# EAGLE design FAL65816_cpua (EAGLE 7.2.0)
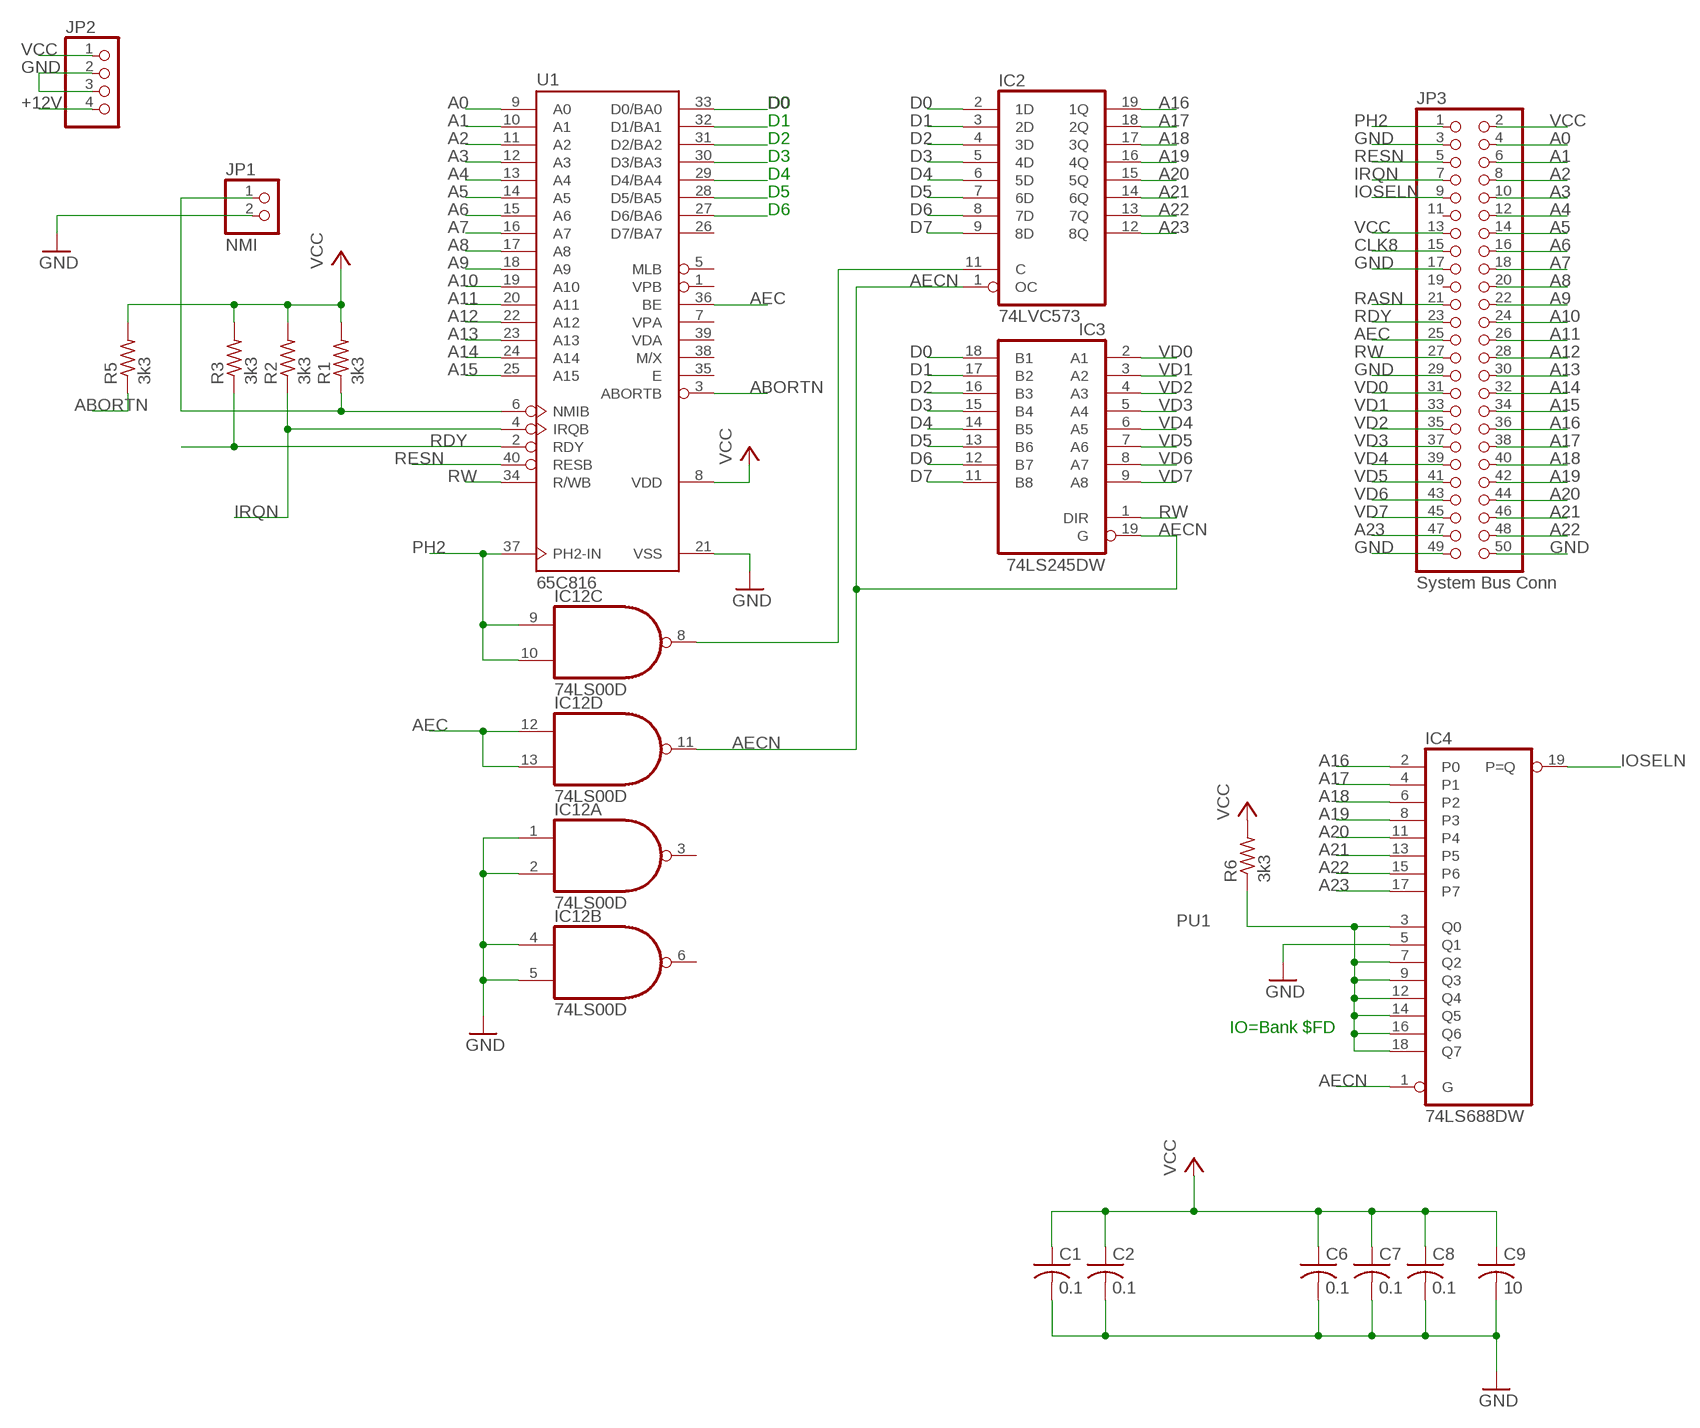
[diagram p0: schematic, sheet 1]

## Parts
C1  0.1  C-US050-024X044  [C050-024X044]
C2  0.1  C-US050-024X044  [C050-024X044]
C6  0.1  C-US050-024X044  [C050-024X044]
C7  0.1  C-US050-024X044  [C050-024X044]
C8  0.1  C-US050-024X044  [C050-024X044]
C9  10  C-US050-024X044  [C050-024X044]
IC2  74LVC573  [SO20W]
IC3  74LS245DW  [SO20W]
IC4  74LS688DW  [SO20W]
IC12  74LS00D  [SO14]
JP1  NMI  PINHD-1X2  [1X02]
JP2  PINHD-1X4/90  [1X04/90]
JP3  System Bus Conn  PINHD-2X25/90  [2X25/90]
R1  3k3  R-US_0207/10  [0207/10]
R2  3k3  R-US_0207/10  [0207/10]
R3  3k3  R-US_0207/10  [0207/10]
R5  3k3  R-US_0207/10  [0207/10]
R6  3k3  R-US_0204/7  [0204/7]
U1  65C816  W65C816SP  [DIP-40]

## Nets
+12V: JP2.4
A0: JP3.4 U1.9(A0)
A1: JP3.6 U1.10(A1)
A2: JP3.8 U1.11(A2)
A3: JP3.10 U1.12(A3)
A4: JP3.12 U1.13(A4)
A5: JP3.14 U1.14(A5)
A6: JP3.16 U1.15(A6)
A7: JP3.18 U1.16(A7)
A8: JP3.20 U1.17(A8)
A9: JP3.22 U1.18(A9)
A10: JP3.24 U1.19(A10)
A11: JP3.26 U1.20(A11)
A12: JP3.28 U1.22(A12)
A13: JP3.30 U1.23(A13)
A14: JP3.32 U1.24(A14)
A15: JP3.34 U1.25(A15)
A16: IC2.19(1Q) IC4.2(P0) JP3.36
A17: IC2.18(2Q) IC4.4(P1) JP3.38
A18: IC2.17(3Q) IC4.6(P2) JP3.40
A19: IC2.16(4Q) IC4.8(P3) JP3.42
A20: IC2.15(5Q) IC4.11(P4) JP3.44
A21: IC2.14(6Q) IC4.13(P5) JP3.46
A22: IC2.13(7Q) IC4.15(P6) JP3.48
A23: IC2.12(8Q) IC4.17(P7) JP3.47
ABORTN: R5.1 U1.3(ABORTB)
AEC: IC12.12(D:I0) IC12.13(D:I1) JP3.25 U1.36(BE)
AECN: IC2.1(OC) IC3.19(G) IC4.1(G) IC12.11(D:O)
CLK8: JP3.15
D0: IC2.2(1D) IC3.18(B1) U1.33(D0/BA0)
D1: IC2.3(2D) IC3.17(B2) U1.32(D1/BA1)
D2: IC2.4(3D) IC3.16(B3) U1.31(D2/BA2)
D3: IC2.5(4D) IC3.15(B4) U1.30(D3/BA3)
D4: IC2.6(5D) IC3.14(B5) U1.29(D4/BA4)
D5: IC2.7(6D) IC3.13(B6) U1.28(D5/BA5)
D6: IC2.8(7D) IC3.12(B7) U1.27(D6/BA6)
D7: IC2.9(8D) IC3.11(B8)
GND: C1.2 C2.2 C6.2 C7.2 C8.2 C9.2 IC4.5(Q1) IC12.1(A:I0) IC12.2(A:I1) IC12.4(B:I0) IC12.5(B:I1) JP1.2 JP2.2 JP2.3 JP3.3 JP3.17 JP3.29 JP3.49 JP3.50 U1.21(VSS)
IOSELN: IC4.19(P=Q) JP3.9
IRQN: JP3.7 R2.1 U1.4(IRQB)
N$1: JP1.1 R1.1 U1.6(NMIB)
N$3: IC2.11(C) IC12.8(C:O)
PH2: IC12.9(C:I0) IC12.10(C:I1) JP3.1 U1.37(PH2-IN)
PU1: IC4.3(Q0) IC4.7(Q2) IC4.9(Q3) IC4.12(Q4) IC4.14(Q5) IC4.16(Q6) IC4.18(Q7) R6.1
RASN: JP3.21
RDY: JP3.23 R3.1 U1.2(RDY)
RESN: JP3.5 U1.40(RESB)
RW: IC3.1(DIR) JP3.27 U1.34(R/WB)
VCC: C1.1 C2.1 C6.1 C7.1 C8.1 C9.1 JP2.1 JP3.2 JP3.13 R1.2 R2.2 R3.2 R5.2 R6.2 U1.8(VDD)
VD0: IC3.2(A1) JP3.31
VD1: IC3.3(A2) JP3.33
VD2: IC3.4(A3) JP3.35
VD3: IC3.5(A4) JP3.37
VD4: IC3.6(A5) JP3.39
VD5: IC3.7(A6) JP3.41
VD6: IC3.8(A7) JP3.43
VD7: IC3.9(A8) JP3.45
Unconnected: IC12.3(A:O) IC12.6(B:O) JP3.11 JP3.19 U1.1(VPB) U1.5(MLB) U1.7(VPA) U1.26(D7/BA7) U1.35(E) U1.38(M/X) U1.39(VDA)

## Notes on the sheet
- IO=Bank $FD

## Power pins joined to a net without a drawn wire
GND: IC2.10(GND) IC3.10(GND) IC4.10(GND) IC12.7(P:GND)
VCC: IC2.20(VCC) IC3.20(VCC) IC4.20(VCC) IC12.14(P:VCC)

## Library data of the parts
C1 C2 C6-C9 = rcl:C-US: CAPACITOR, American symbol
IC2 = FT74xx:74*573: 8-bit D latch BUS DRIVER
IC3 = FT74xx:74*245: Octal BUS TRANSCEIVER, 3-state
IC4 = FT74xx:74*688: 8-bit MAGNITUDE/IDENTITY COMPARATOR, totem pole
IC12 = 74xx-us:74*00: Quad 2-input NAND gate
JP1 = pinhead:PINHD-1X2: PIN HEADER
JP2 = pinhead:PINHD-1X4: PIN HEADER
JP3 = pinhead:PINHD-2X25: PIN HEADER
R1-R3 R5 R6 = resistor:R-US_: RESISTOR, American symbol
U1 = 65xxx:W65C816SP: Wetern Digital Version

## Board
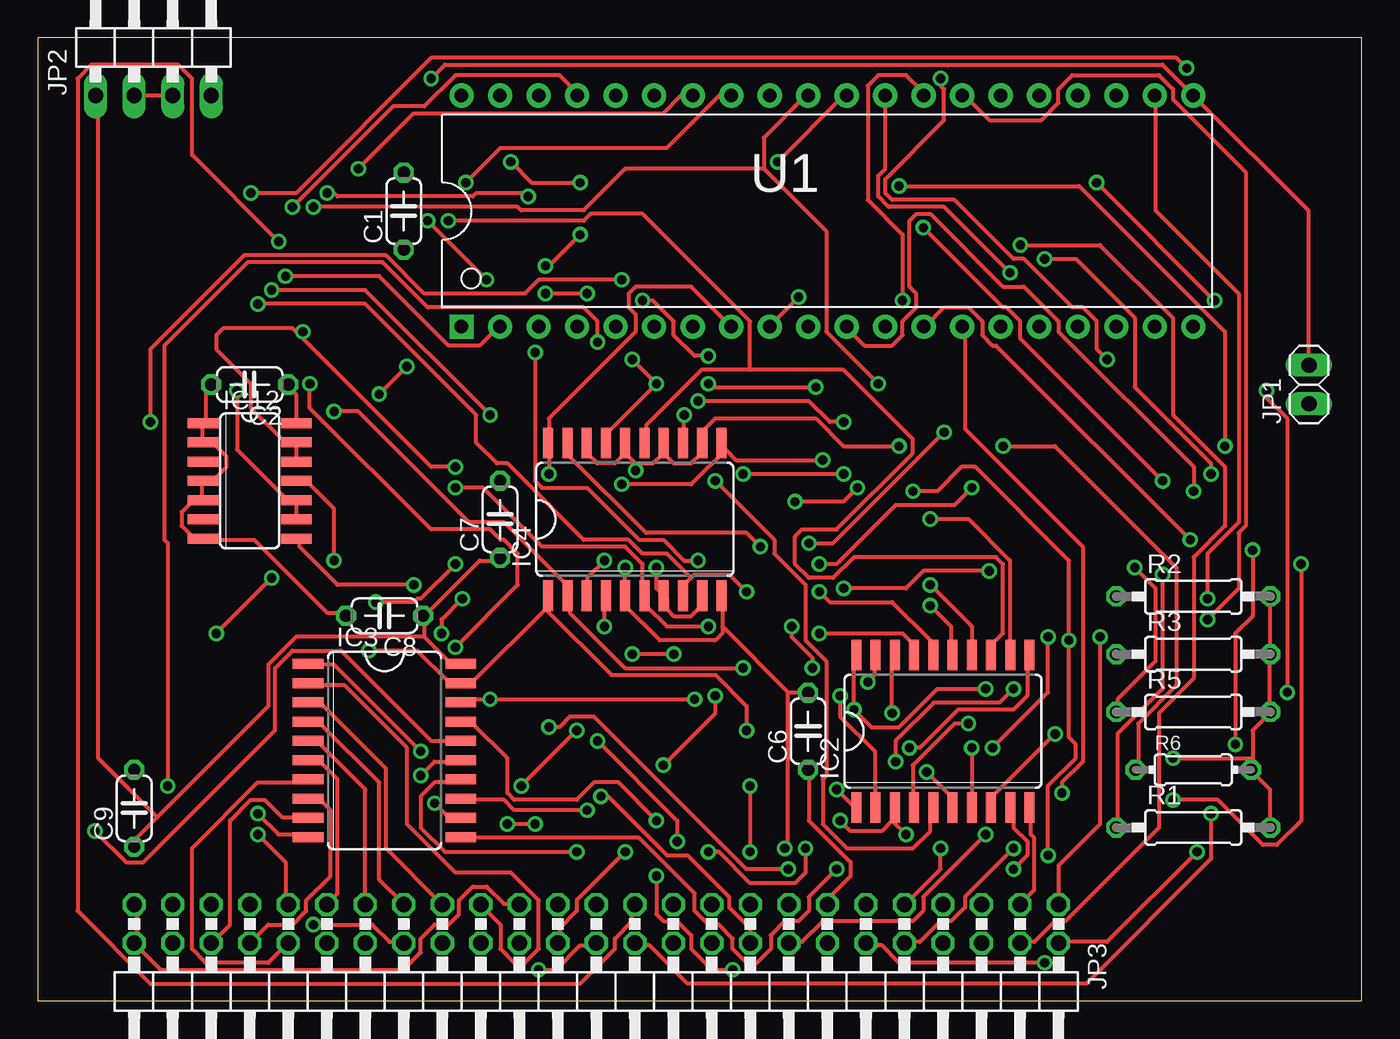
[diagram p1: board, top side]
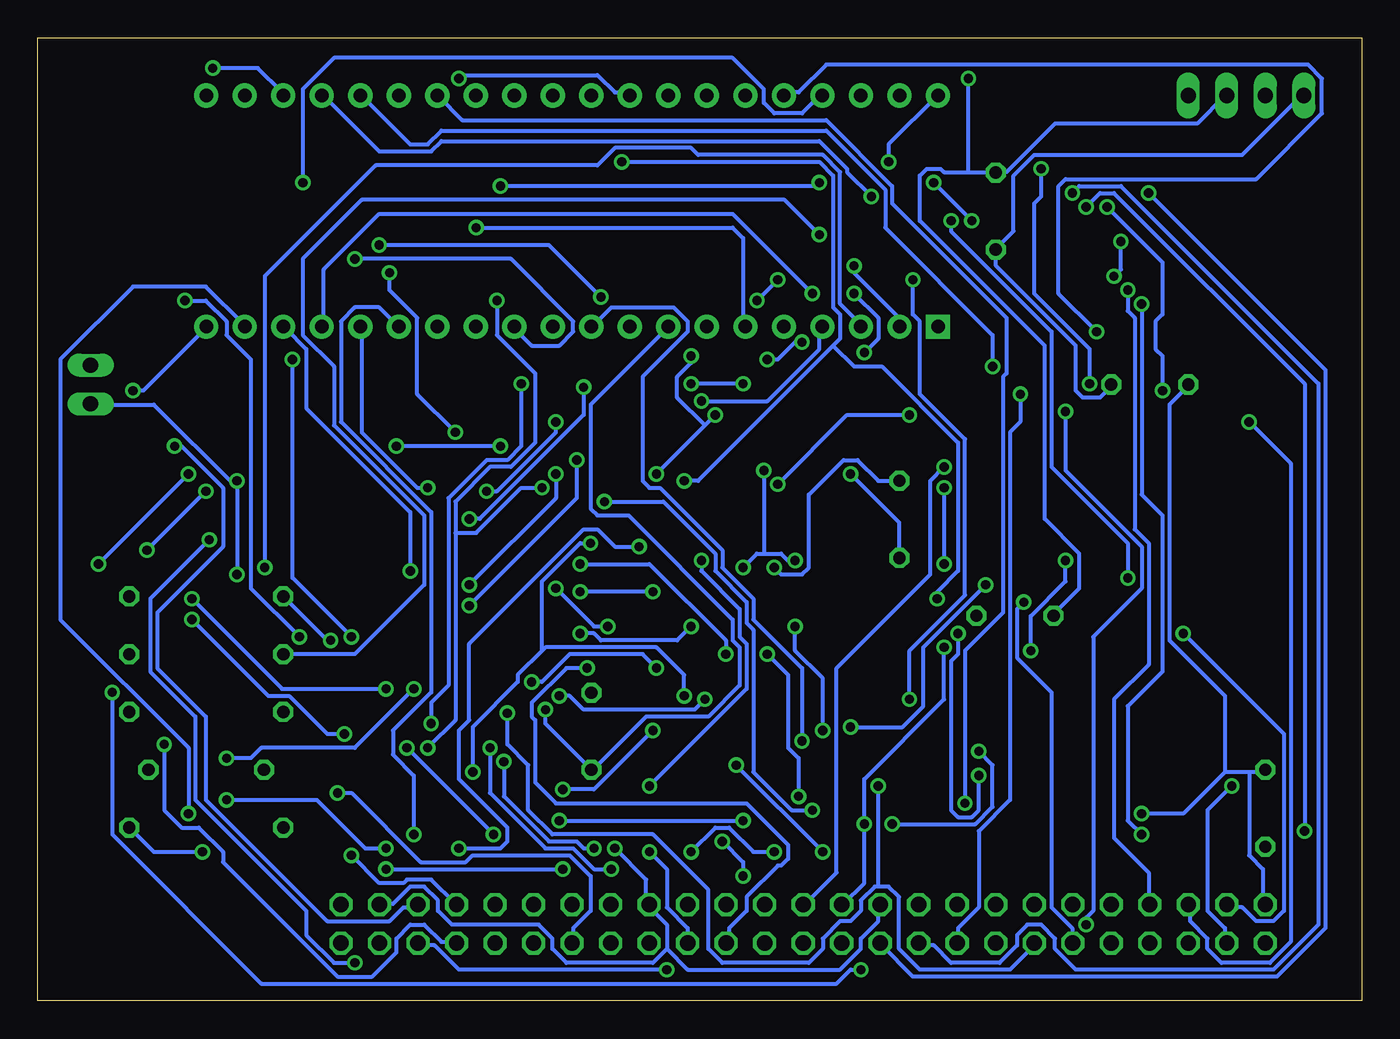
[diagram p2: board, bottom side, seen from below]

Size 87.3 x 63.49 mm. Coordinates in mm from the lower left corner, seen from the top.
Outline: 0,0 87.3,0 87.3,63.49 0,63.49 0,0
Copper layers (1*16): Top 0.035mm / dielectric 1.5mm / Bottom 0.035mm
Design rules "default": minimum track width 10mil, minimum drill 24mil, track to track 8mil, track to pad 8mil, pad to pad 8mil, via to via 8mil, smd to smd 8mil, copper to edge 40mil, drill to drill 8mil, minimum pad ring 10mil, minimum via ring 8mil, stop-mask expansion 4mil, vias tented up to drill 0mil, thermal gap 10mil

### Footprints (pad centres in the part's own frame; a part is rotated, then mirrored left to right if it is on the bottom)
C050-024X044 = drill 0.813 octagon: 1 -2.54,0; 2 2.54,0
SO20W = smd 0.66 x 2.032: 1 -5.715,-5.029; 2 -4.445,-5.029; 3 -3.175,-5.029; 4 -1.905,-5.029; 5 -0.635,-5.029; 6 0.635,-5.029; 7 1.905,-5.029; 8 3.175,-5.029; 9 4.445,-5.029; 10 5.715,-5.029; 11 5.715,5.029; 12 4.445,5.029; 13 3.175,5.029; 14 1.905,5.029; 15 0.635,5.029; 16 -0.635,5.029; 17 -1.905,5.029; 18 -3.175,5.029; 19 -4.445,5.029; 20 -5.715,5.029
SO14 = smd 0.66 x 2.032: 1 -3.81,-3.073; 2 -2.54,-3.073; 3 -1.27,-3.073; 4 0,-3.073; 5 1.27,-3.073; 6 2.54,-3.073; 7 3.81,-3.073; 8 3.81,3.073; 9 2.54,3.073; 10 1.27,3.073; 11 0,3.073; 12 -1.27,3.073; 13 -2.54,3.073; 14 -3.81,3.073
1X02 = drill 1.016 long: 1 -1.27,0; 2 1.27,0
1X04/90 = drill 1.016 long: 1 -3.81,-3.81; 2 -1.27,-3.81; 3 1.27,-3.81; 4 3.81,-3.81
2X25/90 = drill 1.016 octagon: 1 -29.21,-6.35; 2 -29.21,-3.81; 3 -26.67,-6.35; 4 -26.67,-3.81; 5 -24.13,-6.35; 6 -24.13,-3.81; 7 -21.59,-6.35; 8 -21.59,-3.81; 9 -19.05,-6.35; 10 -19.05,-3.81; 11 -16.51,-6.35; 12 -16.51,-3.81; 13 -13.97,-6.35; 14 -13.97,-3.81; 15 -11.43,-6.35; 16 -11.43,-3.81; 17 -8.89,-6.35; 18 -8.89,-3.81; 19 -6.35,-6.35; 20 -6.35,-3.81; 21 -3.81,-6.35; 22 -3.81,-3.81; 23 -1.27,-6.35; 24 -1.27,-3.81; 25 1.27,-6.35; 26 1.27,-3.81; 27 3.81,-6.35; 28 3.81,-3.81; 29 6.35,-6.35; 30 6.35,-3.81; 31 8.89,-6.35; 32 8.89,-3.81; 33 11.43,-6.35; 34 11.43,-3.81; 35 13.97,-6.35; 36 13.97,-3.81; 37 16.51,-6.35; 38 16.51,-3.81; 39 19.05,-6.35; 40 19.05,-3.81; 41 21.59,-3.81; 42 21.59,-6.35; 43 24.13,-3.81; 44 24.13,-6.35; 45 26.67,-3.81; 46 26.67,-6.35; 47 29.21,-3.81; 48 29.21,-6.35; 49 31.75,-3.81; 50 31.75,-6.35
0207/10 = drill 0.813 octagon: 1 -5.08,0; 2 5.08,0
0204/7 = drill 0.813 octagon: 1 -3.81,0; 2 3.81,0
DIP-40 = drill 0.889 pad 1.6 square: 1 -22.86,-7.62 | drill 0.889 pad 1.6: 2 -20.32,-7.62; 3 -17.78,-7.62; 4 -15.24,-7.62; 5 -12.7,-7.62; 6 -10.16,-7.62; 7 -7.62,-7.62; 8 -5.08,-7.62; 9 -2.54,-7.62; 10 0,-7.62; 11 2.54,-7.62; 12 5.08,-7.62; 13 7.62,-7.62; 14 10.16,-7.62; 15 12.7,-7.62; 16 15.24,-7.62; 17 17.78,-7.62; 18 20.32,-7.62; 19 22.86,-7.62; 20 25.4,-7.62; 21 25.4,7.62; 22 22.86,7.62; 23 20.32,7.62; 24 17.78,7.62; 25 15.24,7.62; 26 12.7,7.62; 27 10.16,7.62; 28 7.62,7.62; 29 5.08,7.62; 30 2.54,7.62; 31 0,7.62; 32 -2.54,7.62; 33 -5.08,7.62; 34 -7.62,7.62; 35 -10.16,7.62; 36 -12.7,7.62; 37 -15.24,7.62; 38 -17.78,7.62; 39 -20.32,7.62; 40 -22.86,7.62

### Placement (x,y rotation side)
C1  24.13,52.07 90 top
C2  13.97,40.64 180 top
C6  50.8,17.78 90 top
C7  30.48,31.75 90 top
C8  22.86,25.4 180 top
C9  6.35,12.7 90 top
IC2  59.69,17.78 0 top
IC3  22.86,16.51 270 top
IC4  39.37,31.75 0 top
IC12  13.97,34.29 270 top
JP1  83.82,40.64 90 top
JP2  7.62,63.5 0 top
JP3  38.1,0 180 top
R1  76.2,11.43 0 top
R2  76.2,26.67 0 top
R3  76.2,22.86 0 top
R5  76.2,19.05 0 top
R6  76.2,15.24 0 top
U1  50.8,52.07 0 top

### Tracks (layer width: path | path; a pad name or v marks a point on that pad's centre or on a via)
A0  (via drill 0.61)
  Top 0.254: v64.8,49.84 70.05,49.84 74.85,45.03 74.85,38.63 78.28,35.2 78.28,31.32 76.22,29.26 76.22,21.26 73.94,18.97 73.94,11.43 67.77,5.26 67.08,5.26 65.71,3.89 64.8,3.89 JP3.4 | v50.17,46.41 48.34,44.58 U1.9
  Bottom 0.254: v64.8,49.84 53.59,49.84 v50.17,46.41
A1  (via drill 0.61)
  Top 0.254: v45.82,2.06 44.45,2.06 43.08,3.43 43.08,4.34 42.16,5.26 41.25,5.26 40.79,5.71 v40.79,8.23 | v42.16,10.52 42.16,11.89 v36.91,17.14
  Bottom 0.254: v45.82,2.06 59.54,2.06 61.14,3.66 62.05,3.66 JP3.6 | v40.79,8.23 40.79,9.14 v42.16,10.52 | v36.91,17.14 36.91,21.95 40.11,25.15 40.11,26.52 42.16,28.57 42.16,29.72 46.28,33.83 46.97,33.83 47.42,34.29 47.42,41.15 44.45,44.12 44.45,44.81 45.36,45.72 49.48,45.72 50.62,44.58 U1.10
A2  (via drill 0.61)
  Top 0.254: v78.97,16.92 78.97,24.23 80.11,25.38 v80.11,29.72 | v76.22,33.6 76.22,35.2 67.31,44.12 67.31,44.81 65.02,47.09 63.65,47.09 58.85,51.89 57.94,51.89 57.48,51.44 57.48,47.09 57.94,46.63 57.94,45.72 57.02,44.81 57.02,43.89 56.34,43.2 54.51,43.2 53.36,44.35 U1.11
  Bottom 0.254: v78.97,16.92 78.97,12.57 77.83,11.43 76.68,11.43 75.08,9.83 75.08,9.14 67.54,1.6 65.25,1.6 63.65,3.2 63.65,4.12 62.74,5.03 61.82,5.03 60.68,3.89 59.77,3.89 JP3.8 | v76.22,33.6 v80.11,29.72
A3  (via drill 0.61)
  Top 0.254: v64.34,10.06 61.14,6.86 61.14,6.17 60.22,5.26 59.54,5.26 58.17,3.89 57.25,3.89 JP3.10 | v74.85,13.26 77.83,13.26 80.8,10.29 81.71,10.29 83.31,11.89 v83.31,28.8 | v77.37,34.75 77.37,35.43 72.34,40.46 72.34,45.03 68.45,48.92 v66.4,48.92
  Bottom 0.254: v64.34,10.06 65.71,10.06 68.91,13.26 v74.85,13.26 | v77.37,34.75 v83.31,28.8 | v66.4,48.92 56.11,48.92 51.99,44.81 51.99,44.12 52.91,43.2 54.74,43.2 55.88,44.35 U1.12
A4  (via drill 0.61)
  Top 0.254: v66.4,2.52 56.79,2.52 55.65,3.66 54.74,3.66 JP3.12 | v76,30.4 63.19,43.2 62.97,43.2 62.28,43.89 62.28,44.81 61.37,45.72 59.77,45.72 58.62,44.58 U1.13
  Bottom 0.254: v66.4,2.52 67.77,2.52 69.6,4.34 69.6,5.94 76.91,13.26 76.91,18.75 79.88,21.72 79.88,26.52 v76,30.4
A5  (via drill 0.61)
  Top 0.254: v67.54,13.72 67.54,14.4 68.91,15.77 68.91,29.95 61.14,37.72 61.14,44.35 U1.14
  Bottom 0.254: v67.54,13.72 66.62,13.72 62.05,9.14 59.08,9.14 58.62,9.6 52.22,9.6 50.85,8.23 50.85,5.94 51.99,4.8 51.99,3.89 JP3.14
A6  (via drill 0.61)
  Top 0.254: v62.51,10.97 58.39,6.86 58.39,5.94 57.71,5.26 51.77,5.26 50.39,3.89 49.71,3.89 JP3.16
  Bottom 0.254: v62.51,10.97 62.51,14.86 63.88,16.23 63.88,17.83 61.37,20.34 61.37,32.23 67.31,38.18 67.31,44.81 66.4,45.72 64.8,45.72 63.65,44.58 U1.15
A7  (via drill 0.61)
  Top 0.254: v37.14,13.49 37.59,13.49 41.48,9.6 42.85,9.6 45.59,6.86 45.59,6.17 46.97,4.8 46.97,3.89 JP3.18 | v41.94,22.86 v39.19,22.86 | v51.54,28.8 52.68,28.8 56.57,32.69 60.45,32.69 v61.59,33.83
  Bottom 0.254: v37.14,13.49 37.14,16 37.82,16.69 37.82,21.49 v39.19,22.86 | v41.94,22.86 41.94,23.77 46.97,28.8 v51.54,28.8 | v61.59,33.83 62.28,33.83 65.94,37.49 65.94,44.35 U1.16
A8  (via drill 0.61)
  Top 0.254: v46.97,14.17 v46.97,9.83 | v43.54,29.03 42.62,29.03 41.25,30.4 39.65,30.4 36.22,33.83 33.25,33.83 32.79,34.29 v32.79,42.75 | v36.22,46.63 v33.48,46.63
  Bottom 0.254: JP3.20 44.45,4.8 45.82,6.17 45.82,8.69 v46.97,9.83 | v46.97,14.17 40.56,20.57 40.56,23.55 41.02,24 41.02,25.83 43.54,28.35 v43.54,29.03 | v32.79,42.75 31.88,43.66 31.88,45.03 v33.48,46.63 | v36.22,46.63 41.48,51.89 64.8,51.89 68.45,48.23 68.45,44.58 U1.17
A9  (via drill 0.61)
  Top 0.254: v51.08,21.95 51.08,22.63 49.71,24 v49.71,24.69 | v53.14,27.2 57.25,27.2 58.39,28.35 v62.74,28.35
  Bottom 0.254: v51.08,21.95 52.45,21.95 54.74,19.66 54.74,18.75 54.51,18.52 54.51,14.4 53.14,13.03 40.56,13.03 37.82,10.29 37.82,9.37 38.28,8.91 38.51,8.91 40.56,6.86 40.56,5.94 41.71,4.8 41.71,3.89 JP3.22 | v49.71,24.69 50.62,24.69 v53.14,27.2 | v62.74,28.35 62.74,32.23 69.6,39.09 69.6,42.98 70.97,44.35 U1.18
A10  (via drill 0.61)
  Top 0.254: v77.37,12.34 77.37,9.37 69.14,1.14 42.85,1.14 40.33,3.66 39.42,3.66 JP3.24
  Bottom 0.254: v77.37,12.34 77.37,16.69 85.83,25.15 85.83,42.29 81.03,47.09 76.22,47.09 73.71,44.58 U1.19
A11  (via drill 0.61)
  Top 0.254: v33.02,2.06 34.16,2.06 35.76,3.66 36.68,3.66 JP3.26 | v82.4,20.34 82.4,38.41 81.03,39.78 v81.03,40.23
  Bottom 0.254: v33.02,2.06 33.71,2.06 34.62,1.14 72.57,1.14 82.4,10.97 v82.4,20.34 | v81.03,40.23 80.34,40.23 76.22,44.35 U1.20
A12  (via drill 0.61)
  Top 0.254: v38.73,9.83 35.53,6.63 35.53,5.94 34.39,4.8 34.39,3.89 JP3.28 | v44.22,9.83 44.91,9.83 46.97,7.77 49.94,7.77 50.62,8.46 v50.62,10.06 | v56.57,15.77 56.57,17.14 59.08,19.66 63.42,19.66 v64.34,20.57 | v77.14,26.52 77.14,29.49 79.2,31.55 79.2,46.63 73.71,52.12 73.71,59.66 U1.22
  Bottom 0.254: v38.73,9.83 40.11,9.83 41.71,11.43 42.62,11.43 v44.22,9.83 | v50.62,10.06 51.31,10.06 51.77,10.52 53.59,10.52 56.57,13.49 v56.57,15.77 | v64.34,20.57 71.2,20.57 v77.14,26.52
A13  (via drill 0.61)
  Top 0.254: v14.05,53.26 17.02,53.26 25.93,62.18 75.08,62.18 v75.77,61.49
  Bottom 0.254: v14.05,53.26 2.39,41.6 2.39,4.8 5.59,1.6 29.59,1.6 31.65,3.66 JP3.30 | v75.77,61.49 72.8,61.49 71.2,59.89 U1.23
A14  (via drill 0.61)
  Top 0.254: v19.07,53.26 19.53,53.26 19.76,53.03 28.68,53.03 28.9,53.26 32.11,53.26 v32.33,53.03
  Bottom 0.254: v19.07,53.26 18.62,53.72 15.88,53.72 2.85,40.69 2.85,5.03 5.82,2.06 18.85,2.06 20.22,3.43 20.22,4.12 21.13,5.03 22.05,5.03 22.73,4.34 22.73,3.66 23.88,2.52 27.08,2.52 28.22,3.66 29.13,3.66 JP3.32 | v32.33,53.03 33.93,54.63 33.93,54.86 35.76,56.69 60.68,56.69 61.37,56.01 64.8,56.01 68.45,59.66 U1.24
A15  (via drill 0.61)
  Top 0.254: v24.33,41.83 v22.5,40.01
  Bottom 0.254: v22.5,40.01 22.5,38.18 23.19,37.49 23.19,13.26 25.25,11.2 25.25,6.17 26.62,4.8 26.62,3.89 JP3.34 | v24.33,41.83 24.33,43.89 31.42,50.98 31.42,53.49 35.31,57.38 60.68,57.38 61.59,56.46 62.74,56.46 65.94,59.66 U1.25
A16  (via drill 0.61)
  Top 0.254: v54.74,21.03 55.19,21.49 55.19,22.63 IC2.19 | v46.51,21.95 38.73,21.95 35.08,25.6 35.08,26.52 IC4.2 34.85,26.75 34.85,27.43 30.73,31.55 28.45,31.55 21.13,38.86 v19.53,38.86 | v18.16,5.03 22.05,5.03 23.19,3.89 24.11,3.89 JP3.36
  Bottom 0.254: v54.74,21.03 54.05,21.03 52.22,22.86 47.42,22.86 v46.51,21.95 | v18.16,5.03 18.16,5.49 17.7,5.94 17.7,24 14.5,27.2 14.5,29.95 19.53,34.98 v19.53,38.86
A17  (via drill 0.61)
  Top 0.254: v56.34,18.97 56.34,22.63 IC2.18 | v37.36,24.69 37.36,26.52 IC4.4 | v31.88,14.17 v35.53,17.83
  Bottom 0.254: v56.34,18.97 56.34,16.92 54.97,15.54 54.97,12.57 53.36,10.97 46.74,10.97 43.08,7.32 43.08,3.43 42.16,2.52 36.45,2.52 35.53,3.43 35.53,4.12 34.39,5.26 33.71,5.26 33.02,5.94 33.02,6.63 32.11,7.54 31.88,7.54 | 31.88,7.54 31.19,7.54 30.5,6.86 30.5,3.43 29.13,2.06 23.19,2.06 21.59,3.66 JP3.38 | v37.36,24.69 37.36,23.09 35.53,21.26 v35.53,17.83 | 31.88,7.54 v31.88,14.17
A18  (via drill 0.61)
  Top 0.254: v51.54,24.23 57.02,24.23 57.71,23.55 57.71,22.86 IC2.17 | v44.22,24.69 41.48,24.69 40.11,26.06 40.11,26.52 IC4.6 39.88,26.75 39.88,28.8 38.73,29.95 33.25,29.95 29.36,33.83 v27.53,33.83 | v22.28,26.29 24.79,26.29 25.02,26.52 25.25,26.52 v27.53,28.8
  Bottom 0.254: v51.54,24.23 50.62,24.23 50.17,23.77 45.14,23.77 v44.22,24.69 | v22.28,26.29 22.73,25.83 22.73,22.63 20.45,20.34 20.45,6.17 19.07,4.8 19.07,3.89 JP3.40 | v27.53,33.83 v27.53,28.8
A19  (via drill 0.61)
  Top 0.254: v51.54,26.98 52.22,26.29 56.34,26.29 58.85,23.77 58.85,22.86 IC2.16 | v46.74,26.98 45.59,28.12 43.31,28.12 43.08,27.89 | 43.08,27.89 42.62,27.43 42.62,26.75 IC4.8 | v14.5,10.97 16.33,9.14 16.33,6.4 JP3.42 | v14.5,45.95 21.59,45.95 28.9,38.63 28.9,36.8 30.28,35.43 30.96,35.43 35.99,30.4 38.96,30.4 39.88,29.49 41.48,29.49 43.08,27.89
  Bottom 0.254: v46.74,26.98 v51.54,26.98 | v14.5,10.97 15.42,11.89 15.42,19.43 13.13,21.72 13.13,32 14.5,33.38 v14.5,45.95
A20  (via drill 0.61)
  Top 0.254: v58.85,26.06 60.22,24.69 60.22,22.86 IC2.15 | v51.77,35.66 46.05,35.66 45.36,36.35 | 45.36,36.35 45.14,36.58 IC4.11 45.36,36.35 | v15.42,46.86 21.59,46.86 v29.82,38.63 | v38.51,34.06 43.08,34.06 45.36,36.35
  Bottom 0.254: v58.85,26.06 51.77,33.15 v51.77,35.66 | v15.42,46.86 15.42,45.49 14.96,45.03 14.96,31.09 14.05,30.18 14.05,22.17 16.33,19.89 16.33,10.74 14.05,8.46 14.05,6.4 JP3.44 | v29.82,38.63 33.93,38.63 v38.51,34.06
A21  (via drill 0.61)
  Top 0.254: IC2.14 61.59,24.69 v58.85,27.43 | v46.51,34.75 v53.14,34.75 | v42.62,38.63 42.62,36.8 IC4.13 | v7.42,38.18 7.42,42.98 13.59,49.15 22.96,49.15 25.48,46.63 32.11,46.63 33.02,47.55 v38.51,47.55 | v39.88,46.18 40.56,46.18 41.94,44.81 41.94,43.89 43.31,42.52 v44.22,42.52
  Bottom 0.254: v58.85,27.43 53.14,33.15 v53.14,34.75 | v42.62,38.63 43.31,37.95 | 43.31,37.95 v46.51,34.75 | v7.42,38.18 4.67,35.43 4.67,3.89 6.05,2.52 9.25,2.52 10.16,3.43 10.16,4.12 11.3,5.26 11.3,6.17 JP3.46 | v39.88,46.18 v38.51,47.55 | v44.22,42.52 44.22,42.06 45.14,41.15 45.14,39.78 43.31,37.95
A22  (via drill 0.61)
  Top 0.254: 46.97,41.6 53.14,41.6 57.71,37.03 57.71,36.12 52.68,31.09 50.39,31.09 49.94,30.63 49.94,28.8 50.85,27.89 52.45,27.89 53.82,29.26 63.19,29.26 63.65,28.8 63.65,24.23 62.97,23.55 62.97,22.86 IC2.13 | 46.97,41.6 43.76,41.6 40.11,37.95 40.11,36.8 IC4.15 | v15.42,27.89 v11.76,24.23 | v27.08,51.44 35.99,51.44 36.45,51.89 39.88,51.89 46.97,44.81 46.97,41.6
  Bottom 0.254: v11.76,24.23 5.13,17.6 5.13,5.94 5.82,5.26 6.96,5.26 7.87,6.17 8.79,6.17 JP3.48 | v15.42,27.89 15.42,30.18 20.45,35.2 20.45,44.12 27.08,50.75 v27.08,51.44
A23  (via drill 0.61)
  Top 0.254: v58.85,31.77 61.37,31.77 64.11,29.03 64.11,22.86 IC2.12 | v51.31,40.46 44.45,40.46 v44.22,40.69 | IC4.17 37.59,36.8 37.59,37.49 v40.79,40.69 v39.19,42.29 | v8.56,14.17 8.56,30.18 8.33,30.4 8.33,43.2 13.82,48.69 22.73,48.69 25.71,45.72 35.99,45.72 36.91,44.81 v36.91,43.43
  Bottom 0.254: v58.85,31.77 58.17,31.77 51.31,38.63 v51.31,40.46 | v40.79,40.69 v44.22,40.69 | v8.56,14.17 10.16,12.57 10.16,5.94 9.02,4.8 9.02,3.89 JP3.47 | v36.91,43.43 37.36,43.43 38.51,42.29 v39.19,42.29
ABORTN  (via drill 0.61)
  Top 0.254: v72.34,28.57 73.71,27.2 73.71,22.4 71.2,19.89 71.2,19.2 R5.1
  Bottom 0.254: v72.34,28.57 72.34,47.78 65.02,55.09 50.39,55.09 49.25,56.24 44.22,56.24 43.76,55.78 35.53,55.78 34.39,54.63 34.39,45.95 33.02,44.58 U1.3
AEC  (via drill 0.61)
  Top 0.254: IC12.12 17.02,35.66 17.02,36.8 IC12.13 17.02,37.03 16.1,37.03 14.05,39.09 14.05,40.69 11.76,42.98 11.76,43.89 12.22,44.35 16.79,44.35 17.25,43.89 | 17.25,43.89 25.93,35.2 v27.53,35.2 | 17.25,43.89 v17.48,44.12
  Bottom 0.254: v27.53,35.2 28.45,34.29 28.45,28.12 34.62,21.95 34.62,8.46 36.68,6.4 JP3.25 | v17.48,44.12 19.99,46.63 19.99,53.72 19.53,54.18 6.96,54.18 2.62,58.52 2.62,60.81 3.53,61.72 35.31,61.72 37.14,59.89 38.05,59.89 U1.36
AECN  (via drill 0.61)
  Top 0.254: 33.48,25.83 28.68,21.03 27.99,21.03 IC3.19 27.76,21.03 27.08,21.03 25.02,23.09 v21.82,23.09 | 33.48,25.83 33.48,26.52 IC4.1 33.48,25.83 | IC12.11 17.7,34.29 19.53,32.46 v19.53,29.03 | v52.68,13.95 53.82,12.8 IC2.1 | v46.74,17.83 46.74,19.43 44.68,21.49 37.82,21.49 33.48,25.83
  Bottom 0.254: v19.53,29.03 19.53,27.66 21.82,25.38 v21.82,23.09 | v52.68,13.95 50.62,13.95 v46.74,17.83
D0  (via drill 0.61)
  Top 0.254: v52.91,20.12 52.91,18.75 55.19,16.46 55.19,12.8 IC2.2 | v43.31,19.89 v29.82,19.89 27.99,19.89 IC3.18 | v28.22,53.95 30.5,56.24 41.48,56.24 44.91,59.66 45.59,59.66 U1.33 | v29.59,47.55 v25.71,51.44
  Bottom 0.254: v52.91,20.12 52.22,20.12 51.31,19.2 43.99,19.2 v43.31,19.89 | v25.71,51.44 v28.22,53.95 | v29.59,47.55 29.59,45.26 29.13,44.81 29.13,40.01 26.16,37.03 26.16,26.75 29.82,23.09 v29.82,19.89
D1  (via drill 0.61)
  Top 0.254: v40.79,11.89 38.28,14.4 36.68,14.4 35.53,13.26 31.42,13.26 30.96,13.72 30.96,16 28.68,18.29 27.99,18.29 IC3.17 | v52.91,11.89 53.59,11.2 55.65,11.2 56.34,11.89 | 56.34,11.89 56.34,12.57 IC2.3 56.34,11.89 | v59.54,60.81 59.54,60.35 59.77,60.12 59.77,58.06 55.88,54.18 55.88,53.26 56.34,52.81 60.45,52.81 64.34,48.92 65.02,48.92 68.22,45.72 68.91,45.72 69.83,44.81 69.83,42.98 v70.51,42.29 | v66.62,24 66.62,20.34 v62.97,16.69 | 56.34,11.89 v57.25,10.97
  Bottom 0.254: v52.91,11.89 v40.79,11.89 | v59.54,60.81 59.31,61.04 50.39,61.04 49.25,59.89 48.34,59.89 U1.32 | v70.51,42.29 70.51,27.89 v66.62,24 | v57.25,10.97 v62.97,16.69
D2  (via drill 0.61)
  Top 0.254: v61.37,18.29 60.45,18.29 57.71,15.54 57.71,12.8 IC2.4 | v55.42,40.69 51.99,44.12 51.99,50.75 47.88,54.86 | 47.88,54.86 47.88,56.92 50.62,59.66 U1.31 | IC3.16 25.93,17.14 19.99,23.09 16.79,23.09 15.65,21.95 15.65,17.83 6.96,9.14 5.82,9.14 v3.76,11.2 | v18.16,52.35 31.65,52.35 31.88,52.12 35.99,52.12 38.73,54.86 47.88,54.86
  Bottom 0.254: v61.37,18.29 61.37,19.66 60.22,20.8 60.22,33.15 57.71,35.66 56.34,35.66 55.42,36.58 v55.42,40.69 | v3.76,11.2 3.76,40.69 16.33,53.26 17.25,53.26 v18.16,52.35
D3  (via drill 0.61)
  Top 0.254: v44.68,34.29 48.56,30.4 48.56,29.49 50.62,27.43 50.62,23.77 51.99,22.4 51.99,14.86 51.77,14.63 51.77,11.66 53.36,10.06 57.71,10.06 58.85,11.2 58.85,12.57 IC2.5 | v48.79,55.32 53.14,59.66 U1.30 | v25.25,14.86 26.16,15.77 27.76,15.77 IC3.15 | v26.62,24.23 26.62,25.15 v27.99,26.52
  Bottom 0.254: v44.68,34.29 43.76,34.29 34.85,43.2 | 34.85,43.2 34.39,43.66 34.39,45.26 34.85,45.72 34.85,54.41 35.76,55.32 v48.79,55.32 | v25.25,14.86 25.25,12.57 25.71,12.12 26.62,12.12 27.08,12.57 27.08,22.4 26.62,22.86 v26.62,24.23 | v27.99,26.52 27.99,26.98 26.62,28.35 26.62,36.8 31.65,41.83 33.48,41.83 34.85,43.2
D4  (via drill 0.61)
  Top 0.254: v58.62,15.09 60.22,13.49 60.22,12.8 IC2.6 | v44.68,20.12 44.68,18.97 v41.25,15.54 | v35.53,9.83 26.85,9.83 25.25,11.43 25.25,13.49 26.16,14.4 27.76,14.4 IC3.14 | U1.29 55.88,54.86 55.42,54.41 55.42,53.03 56.11,52.35 59.77,52.35 v64.11,48.01 | v59.77,37.49 52.45,30.18 v50.85,30.18
  Bottom 0.254: v58.62,15.09 58.62,18.06 55.65,21.03 55.65,21.49 54.05,23.09 | 54.05,23.09 53.82,23.32 46.51,23.32 44.68,21.49 v44.68,20.12 | v35.53,9.83 v41.25,15.54 | v64.11,48.01 64.11,46.86 62.28,45.03 62.28,40.01 v59.77,37.49 | v50.85,30.18 51.54,30.18 54.05,27.66 54.05,23.09
D5  (via drill 0.61)
  Top 0.254: v61.59,16.69 IC2.7 | v57.02,46.18 57.02,50.52 54.74,52.81 54.74,60.35 55.42,61.04 57.25,61.04 58.39,59.89 U1.28 | v36.22,12.57 31.42,12.57 30.73,13.26 27.99,13.26 IC3.13 | v49.94,32.92 53.14,32.92 v54.05,33.83
  Bottom 0.254: v61.59,16.69 59.77,18.52 59.77,30.86 | 59.77,30.86 59.77,32.92 57.48,35.2 56.11,35.2 54.51,36.8 54.51,41.38 57.02,43.89 v57.02,46.18 | v36.22,12.57 37.59,12.57 40.11,15.09 40.11,24.46 40.56,24.92 40.56,26.29 42.62,28.35 42.62,29.49 46.05,32.92 v49.94,32.92 | v54.05,33.83 55.42,33.83 58.39,30.86 59.77,30.86
D6  (via drill 0.61)
  Top 0.254: v26.16,13.03 27.08,12.12 27.76,12.12 IC3.12 | v67.08,17.6 62.97,13.49 62.97,12.8 IC2.8 | v77.14,25.15 79.2,27.2 79.2,30.86 79.65,31.32 79.65,54.63 74.85,59.44 74.85,60.12 73.94,61.04 68.22,61.04 67.31,60.12 67.31,59.21 66.17,58.06 62.74,58.06 61.14,59.66 U1.27
  Bottom 0.254: v26.16,13.03 26.16,23.09 23.65,25.6 23.65,41.15 23.42,41.38 23.42,45.03 30.96,52.58 30.96,53.72 35.31,58.06 59.31,58.06 60.91,59.66 U1.27 | v67.08,17.6 68.22,17.6 70.74,20.12 72.11,20.12 v77.14,25.15
D7  (via drill 0.61)
  Top 0.254: v52.68,8.69 50.85,6.86 50.85,5.94 50.17,5.26 49.25,5.26 48.34,4.34 48.34,3.43 47.42,2.52 46.74,2.52 45.82,3.43 45.82,4.12 44.91,5.03 44.22,5.03 43.31,5.94 43.31,7.09 39.65,10.74 27.99,10.74 IC3.11 | v64.34,8.69 65.25,9.6 65.25,10.52 64.34,11.43 64.34,12.57 IC2.9
  Bottom 0.254: v64.34,8.69 v52.68,8.69
GND  (via drill 0.61)
  Top 0.254: 45.14,24.69 45.14,26.52 IC4.10 | 45.14,24.69 45.14,24.23 44.68,23.77 41.02,23.77 38.73,26.06 IC4.5 v38.73,28.57 | 49.48,20.34 50.62,20.34 C6.2 | 45.14,24.69 49.48,20.34 | IC2.10 65.48,12.57 65.48,10.97 65.71,10.74 65.71,7.32 64.8,6.4 JP3.3 | 49.48,20.34 49.48,10.29 v49.25,10.06 | JP1.2 83.77,42.06 83.77,52.12 U1.21 74.17,61.72 26.85,61.72 v25.93,60.81 | JP2.2 6.5,59.66 8.79,59.66 JP2.3 | JP3.50 6.5,6.17 6.5,3.89 JP3.49 8.1,2.06 24.11,2.06 25.25,3.2 25.25,4.12 26.16,5.03 27.08,5.03 27.76,5.71 27.76,6.63 28.68,7.54 29.59,7.54 30.73,6.4 31.65,6.4 JP3.29 | v14.5,12.34 15.88,10.97 17.7,10.97 IC3.10 | C2.2 11.3,40.46 11.07,40.23 11.07,38.18 IC12.1 10.85,37.95 10.85,37.03 IC12.2 11.07,36.8 11.53,36.8 12.45,35.89 12.45,35.2 11.53,34.29 IC12.4 10.85,34.29 10.85,33.15 IC12.5 10.85,32.92 10.16,32.92 9.47,32.23 9.47,31.32 10.16,30.63 10.85,30.63 IC12.7 11.07,30.4 14.28,30.4 19.07,25.6 20.22,25.6 C8.2
  Bottom 0.254: C7.2 31.88,34.29 33.25,35.66 34.16,35.66 36.45,33.38 36.45,28.57 36.91,28.12 38.28,28.12 v38.73,28.57 | 45.82,3.43 44.45,2.06 34.39,2.06 33.02,3.43 33.02,4.12 31.88,5.26 31.88,6.17 JP3.29 | 45.82,3.43 45.82,5.03 46.97,6.17 JP3.17 47.19,6.4 47.19,8 v49.25,10.06 | 45.82,3.43 46.74,2.52 52.45,2.52 53.36,3.43 53.36,4.12 54.28,5.03 59.99,5.03 60.91,5.94 60.91,6.63 61.82,7.54 62.74,7.54 63.88,6.4 64.57,6.4 JP3.3 | JP2.3 9.02,59.66 10.85,57.84 20.22,57.84 23.42,54.63 24.11,54.63 C1.2 24.33,54.63 25.93,54.63 | v14.5,12.34 11.76,12.34 9.02,15.09 | 7.42,15.09 6.5,15.09 C9.2 | 7.42,15.09 9.02,15.09 | 7.42,15.09 7.42,9.6 6.5,8.69 6.5,6.4 JP3.50 | 9.02,15.09 9.02,20.12 12.68,23.77 12.68,39.32 11.53,40.46 C2.2 | 25.93,54.63 27.53,54.63 27.76,54.86 28.68,54.86 29.13,54.41 29.13,51.44 20.9,43.2 20.9,31.77 18.62,29.49 18.62,27.2 20.22,25.6 C8.2 | 25.93,54.63 v25.93,60.81
IOSELN  (via drill 0.61)
  Top 0.254: v47.65,29.95 46.74,30.86 40.11,30.86 35.08,35.89 35.08,36.58 IC4.19 | v59.54,10.06 59.54,8.69 57.25,6.4 JP3.9
  Bottom 0.254: v47.65,29.95 49.25,29.95 50.39,31.09 51.31,31.09 58.85,23.55 58.85,18.52 59.54,17.83 59.54,14.63 56.34,11.43 56.34,10.52 56.79,10.06 v59.54,10.06
IRQN  (via drill 0.61)
  Top 0.254: v66.62,9.6 66.62,14.17 68.45,16 68.45,16.92 68,17.37 v68,23.77 68,29.03 61.82,35.2 60.91,35.2 59.31,33.6 v57.71,33.6 | v43.54,39.55 50.85,39.55 52.22,38.18 v53.14,38.18
  Bottom 0.254: R2.1 68.22,23.77 v68,23.77 | v66.62,9.6 64.8,7.77 63.19,7.77 62.97,8 61.37,8 59.77,6.4 JP3.7 | v43.54,39.55 39.19,39.55 35.76,42.98 35.76,44.35 U1.4 | v53.14,38.18 53.14,37.49 57.02,33.6 v57.71,33.6
N$1  (via drill 0.61)
  Top 0.254: v74.17,28.12 74.17,20.57 71.2,17.6 71.2,11.43 R1.1 | v58.39,50.98 63.65,45.72 63.88,45.72 64.8,44.81 64.8,43.66 v74.17,34.29
  Bottom 0.254: v74.17,28.12 74.17,33.83 74.4,34.06 | 74.4,34.06 79.65,39.32 83.77,39.32 JP1.1 | v58.39,50.98 41.48,50.98 40.79,50.29 40.79,44.58 U1.6 | 74.4,34.06 v74.17,34.29
N$3  (via drill 0.61)
  Top 0.254: v24.79,27.43 19.76,27.43 17.25,29.95 17.25,30.4 IC12.8 | v33.71,18.06 34.39,18.06 35.08,18.75 36.68,18.75 46.74,8.69 v49.48,8.69 | v57.48,16.69 58.17,16.69 60.68,19.2 64.34,19.2 65.25,20.12 65.25,22.63 IC2.11
  Bottom 0.254: v24.79,27.43 28.9,23.32 28.9,19.43 30.28,18.06 v33.71,18.06 | v49.48,8.69 50.62,8.69 51.99,10.06 53.82,10.06 57.48,13.72 v57.48,16.69
PH2  (via drill 0.61)
  Top 0.254: IC12.9 17.02,31.77 17.02,32.92 IC12.10 17.02,33.15 16.33,33.15 13.13,36.35 v13.13,40.23 | v16.79,52.35 23.42,58.98 25.48,58.98 27.53,61.04 34.39,61.04 35.53,59.89 U1.37 | JP3.1 67.31,8.91 70.05,11.66 v70.05,24 | v69.83,53.95 v77.6,46.18
  Bottom 0.254: v13.13,40.23 13.13,42.52 13.59,42.98 13.59,44.81 13.13,45.26 13.13,48.69 v16.79,52.35 | v70.05,24 73.25,27.2 73.25,42.29 74.85,43.89 74.85,44.81 76.22,46.18 v77.6,46.18 | v69.83,53.95 69.83,60.12 67.77,62.18 41.48,62.18 39.42,60.12 39.42,59.21 38.73,58.52 36.91,58.52 35.76,59.66 U1.37
PU1  (via drill 0.61)
  Top 0.254: v37.36,29.03 36.22,27.89 36.22,26.75 IC4.3 | v40.79,28.57 40.79,27.2 IC4.7 41.48,26.52 41.48,25.83 41.94,25.38 43.08,25.38 43.76,26.06 43.76,26.52 IC4.9 | 38.73,36.12 38.05,35.43 36.91,35.43 36.22,36.12 36.22,36.58 IC4.18 | 38.73,36.12 IC4.16 38.73,36.58 | 41.25,36.12 41.25,36.58 IC4.14 41.25,36.12 | 41.25,36.12 40.56,35.43 39.42,35.43 | 38.73,36.12 39.42,35.43 | 41.25,36.12 41.94,35.43 43.08,35.43 43.76,36.12 43.76,36.58 IC4.12 43.99,36.8 43.99,37.72 44.68,38.41 51.31,38.41 53.14,36.58 v56.79,36.58 | v63.65,36.58 67.08,36.58 75.08,28.57 75.08,20.8 72.57,18.29 72.57,15.32 R6.1 | 39.42,35.43 v39.42,34.98
  Bottom 0.254: v37.36,29.03 37.82,29.03 38.28,29.49 39.42,29.49 | 39.42,29.49 39.88,29.49 v40.79,28.57 | v56.79,36.58 v63.65,36.58 | v39.42,34.98 39.42,29.49
RDY  (via drill 0.61)
  Top 0.254: v35.76,50.52 33.71,48.46 v33.48,48.46 | v15.88,50.06 10.16,55.78 10.16,60.81 9.25,61.72 3.53,61.72 2.62,60.81 2.62,5.94 7.42,1.14 35.76,1.14 38.05,3.43 38.05,4.12 39.19,5.26 39.19,6.17 JP3.23 | v16.33,47.78 22.5,47.78 27.08,43.2 29.13,43.2 30.28,44.35 U1.2
  Bottom 0.254: R3.1 66.4,22.86 61.82,27.43 61.82,32 67.77,37.95 67.77,41.83 69.83,43.89 69.83,48.92 65.94,52.81 38.05,52.81 v35.76,50.52 | v33.48,48.46 33.48,48.01 30.5,45.03 30.5,44.58 U1.2 | v15.88,50.06 15.88,48.23 v16.33,47.78
RESN  (via drill 0.61)
  Top 0.254: v78.28,36.58 78.28,44.12 68.68,53.72 v56.79,53.72 | v35.76,53.95 32.56,53.95 v31.19,55.32
  Bottom 0.254: v78.28,36.58 77.83,36.58 75.08,33.83 75.08,29.95 79.43,25.6 79.43,21.95 76.22,18.75 76.22,13.26 68.22,5.26 64.11,5.26 63.19,6.17 62.28,6.17 JP3.5 | v56.79,53.72 35.99,53.72 v35.76,53.95 | v31.19,55.32 31.19,56.46 27.99,59.66 U1.40
RW  (via drill 0.61)
  Top 0.254: v25.25,16.46 19.53,22.17 17.93,22.17 IC3.1 | v32.79,11.66 v30.96,11.66 | v21.13,54.86 24.79,58.52 41.25,58.52 42.39,59.66 43.08,59.66 U1.34 | v17.93,40.69 17.93,39.09 25.93,31.09 29.82,31.09 30.5,30.4 30.73,30.4 31.65,29.49 31.65,27.43 v27.53,23.32
  Bottom 0.254: v25.25,16.46 24.33,15.54 24.33,12.8 25.48,11.66 v30.96,11.66 | JP3.27 34.16,6.4 32.79,7.77 v32.79,11.66 32.79,14.63 27.53,19.89 v27.53,23.32 | v21.13,54.86 21.13,53.03 21.59,52.58 21.59,46.63 17.93,42.98 v17.93,40.69
VCC  (via drill 0.61)
  Top 0.254: IC12.14 17.02,38.18 17.02,40.01 16.56,40.46 C2.1 | 25.48,24 27.08,22.4 27.76,22.4 IC3.20 | 25.48,25.38 25.48,24 | 7.87,12.12 15.19,19.43 15.19,22.17 17.02,24 25.48,24 | 7.87,12.12 6.5,10.74 6.5,10.29 C9.1 | 25.48,25.38 29.13,29.03 30.28,29.03 C7.1 | 25.48,25.38 C8.1 | 7.87,12.12 3.99,16 3.99,59.66 JP2.1 | 81.25,22.86 81.25,26.52 R2.2 | 80.11,16 80.11,17.83 81.25,18.97 R5.2 81.25,19.2 81.25,22.86 | 80.11,16 80.11,15.32 R6.2 80.11,15.09 81.25,13.95 81.25,11.43 R1.2 | v76.45,9.83 70.51,3.89 67.31,3.89 JP3.2 | 81.25,22.86 R3.2 | IC2.20 53.82,22.63 v53.82,19.2 54.97,18.06 56.79,18.06 59.31,20.57 v62.51,20.57 | JP3.13 52.22,6.4 52.22,6.86 53.59,8.23 53.59,9.14 50.85,11.89 50.85,15.09 C6.1 | U1.8 43.08,47.09 39.42,47.09 38.96,46.63 38.96,45.72 39.42,45.26 39.42,44.12 33.71,38.41 33.71,36.8 IC4.20 33.71,36.58 v33.71,34.75 | v74.85,16 80.11,16
  Bottom 0.254: C2.1 16.56,40.46 17.25,39.78 18.39,39.78 18.85,40.23 18.85,43.2 24.11,48.46 24.11,49.38 C1.1 24.11,49.61 22.96,50.75 22.96,54.41 21.59,55.78 7.87,55.78 3.99,59.66 JP2.1 | v76.45,9.83 79.65,9.83 81.25,11.43 R1.2 | v53.82,19.2 53.82,18.29 50.85,15.32 C6.1 50.62,15.32 47.19,18.75 43.08,18.75 41.02,20.8 41.02,23.32 41.48,23.77 41.48,25.15 48.34,32 50.39,32 50.85,32.46 50.85,39.32 U1.8 | v74.85,16 73.25,16 72.57,16.69 66.4,16.69 v62.51,20.57 | v33.71,34.75 30.5,31.55 30.5,29.26 C7.1
VD0
  Top 0.254: IC3.2 17.93,20.8 20.22,20.8 24.33,16.69 24.33,11.66 27.53,8.46 31.19,8.46 33.02,6.63 33.02,3.43 32.11,2.52 31.42,2.52 30.5,3.43 30.5,5.03 29.36,6.17 JP3.31
VD1
  Top 0.254: JP3.33 22.96,10.06 22.96,15.32 18.62,19.66 17.93,19.66 IC3.3
VD2
  Top 0.254: IC3.4 17.93,18.29 18.62,18.29 22.5,14.4 22.5,8 24.11,6.4 JP3.35
VD3
  Top 0.254: IC3.5 18.39,17.14 21.59,13.95 JP3.37
VD4
  Top 0.254: IC3.6 17.93,15.77 18.62,15.77 19.76,14.63 19.76,7.09 19.07,6.4 JP3.39
VD5
  Top 0.254: IC3.7 17.7,14.4 14.5,14.4 10.16,10.06 10.16,3.43 11.07,2.52 15.19,2.52 16.33,3.66 JP3.41
VD6
  Top 0.254: JP3.43 15.19,5.03 16.79,5.03 17.7,5.94 17.7,6.63 19.3,8.23 19.3,12.57 18.62,13.26 17.93,13.26 IC3.8
VD7
  Top 0.254: IC3.9 17.7,12.12 16.1,12.12 14.96,13.26 14.05,13.26 12.68,11.89 12.68,5.03 11.53,3.89 JP3.45